# EAGLE design A2530 (EAGLE 7.1.0)
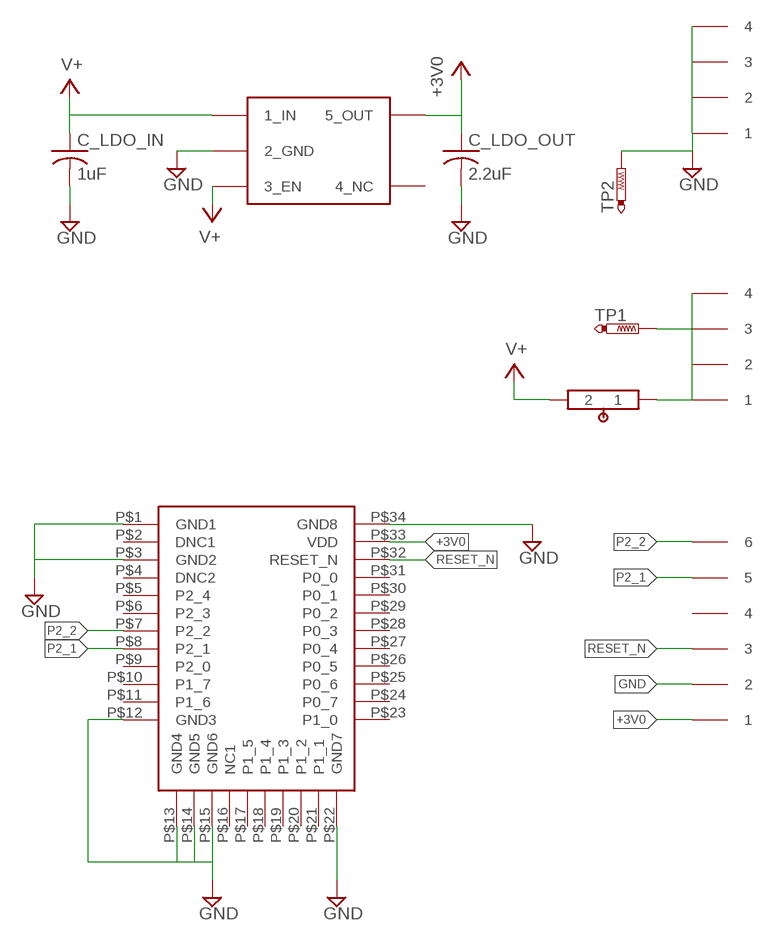
[diagram p0: schematic, sheet 1]

## Parts
C_LDO_IN  1uF  C-USC0603  [C0603]
C_LDO_OUT  2.2uF  C-USC0603  [C0603]
TP1  PTR1B2,54  [B2,54]
TP2  PTR1B2,54  [B2,54]
U$1  A2530  [A2530]
U$2  FFC6POS  [FFC6POS]
U$7  FFC4POS  [FFC4POS]
U$8  FFC4POS  [FFC4POS]
U$18  SWITCH_MANUAL  [SWITCH_MANUAL]
VREG1  REGULATOR  [REGULATOR]

## Nets
+3V0: C_LDO_OUT.1 U$1.P$33(VDD) U$2.1 VREG1.5(5_OUT)
GND: C_LDO_IN.2 C_LDO_OUT.2 TP2.TP U$1.P$1(GND1) U$1.P$3(GND2) U$1.P$12(GND3) U$1.P$13(GND4) U$1.P$14(GND5) U$1.P$15(GND6) U$1.P$22(GND7) U$1.P$34(GND8) U$2.2 U$8.1 U$8.2 U$8.3 U$8.4 VREG1.2(2_GND)
N$4: TP1.TP U$7.1 U$7.2 U$7.3 U$7.4 U$18.1
P2_1: U$1.P$8(P2_1) U$2.5
P2_2: U$1.P$7(P2_2) U$2.6
RESET_N: U$1.P$32(RESET_N) U$2.3
V+: C_LDO_IN.1 U$18.2 VREG1.1(1_IN) VREG1.3(3_EN)
Unconnected: U$1.P$2(DNC1) U$1.P$4(DNC2) U$1.P$5(P2_4) U$1.P$6(P2_3) U$1.P$9(P2_0) U$1.P$10(P1_7) U$1.P$11(P1_6) U$1.P$16(NC1) U$1.P$17(P1_5) U$1.P$18(P1_4) U$1.P$19(P1_3) U$1.P$20(P1_2) U$1.P$21(P1_1) U$1.P$23(P1_0) U$1.P$24(P0_7) U$1.P$25(P0_6) U$1.P$26(P0_5) U$1.P$27(P0_4) U$1.P$28(P0_3) U$1.P$29(P0_2) U$1.P$30(P0_1) U$1.P$31(P0_0) U$2.4 VREG1.4(4_NC)

## Library data of the parts
C_LDO_IN C_LDO_OUT = resistor:C-US: CAPACITOR, American symbol
TP1 TP2 = testpad:PTR1: TEST PIN
U$1 = CC2530_PCB_TL:A2530
U$2 = CC2530_PCB_TL:FFC6POS: FFC Connector 6POS
U$7 U$8 = CC2530_PCB_TL:FFC4POS: FFC COnnector 4POS
U$18 = CC2530_PCB_TL:SWITCH_MANUAL
VREG1 = CC2530_PCB_TL:REGULATOR: IC REG LDO 3V 50MA SOT23-5 TPS76030DBVT

## Board
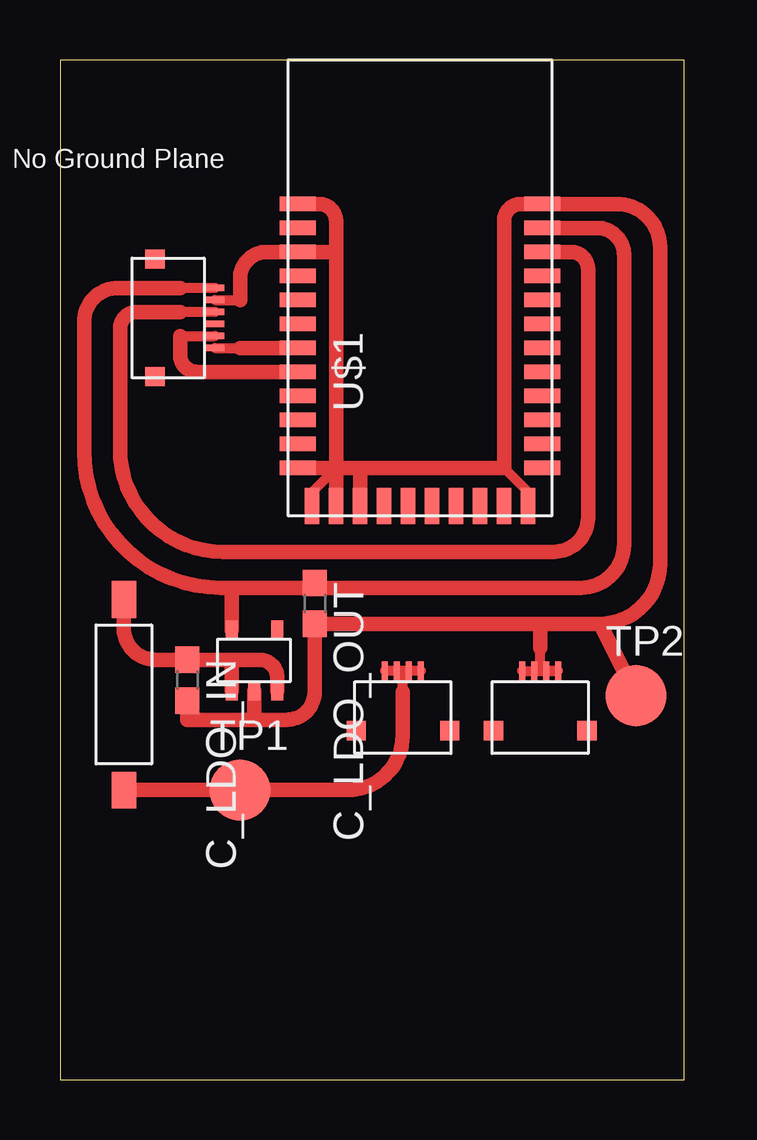
[diagram p1: board, top side]

Size 26 x 42.5 mm. Coordinates in mm from the lower left corner, seen from the top.
Outline: 0,0 26,0 26,42.5 0,42.5 0,0
Copper layers (1*16): Top 0.035mm / dielectric 1.5mm / Bottom 0.035mm
Design rules "default": minimum track width 10mil, minimum drill 24mil, track to track 8mil, track to pad 8mil, pad to pad 8mil, via to via 8mil, smd to smd 8mil, copper to edge 40mil, drill to drill 8mil, minimum pad ring 10mil, minimum via ring 8mil, stop-mask expansion 4mil, vias tented up to drill 0mil, thermal gap 10mil

### Footprints (pad centres in the part's own frame; a part is rotated, then mirrored left to right if it is on the bottom)
C0603 = smd 1.1 x 1: 1 -0.85,0; 2 0.85,0
B2,54 = smd 2.54 x 2.54: TP 0,0
A2530 = smd 1.5 x 0.61: P$1 -5.1,0; P$2 -5.1,-1; P$3 -5.1,-2; P$4 -5.1,-3; P$5 -5.1,-4; P$6 -5.1,-5; P$7 -5.1,-6; P$8 -5.1,-7; P$9 -5.1,-8; P$10 -5.1,-9; P$11 -5.1,-10; P$12 -5.1,-11; P$23 5.1,-11; P$24 5.1,-10; P$25 5.1,-9; P$26 5.1,-8; P$27 5.1,-7; P$28 5.1,-6; P$29 5.1,-5; P$30 5.1,-4; P$31 5.1,-3; P$32 5.1,-2; P$33 5.1,-1; P$34 5.1,0 | smd 0.61 x 1.5: P$13 -4.5,-12.6; P$14 -3.5,-12.6; P$15 -2.5,-12.6; P$16 -1.5,-12.6; P$17 -0.5,-12.6; P$18 0.5,-12.6; P$19 1.5,-12.6; P$20 2.5,-12.6; P$21 3.5,-12.6; P$22 4.5,-12.6
FFC6POS = smd 0.762 x 0.254: 1 0.008,1.269; 2 0.008,0.769; 3 0.008,0.269; 4 0.008,-0.231; 5 0.008,-0.731; 6 0.008,-1.231 | smd 0.8 x 0.8: P$7 -2.49,2.47; P$8 -2.49,-2.43
FFC4POS = smd 0.762 x 0.254: 1 0.04,0.742; 2 0.04,0.242; 3 0.04,-0.258; 4 0.04,-0.758 | smd 0.8 x 0.8: P$5 -2.46,1.94; P$6 -2.46,-1.96
SWITCH_MANUAL = smd 1.524 x 1.016: 1 -4.13,0; 2 3.81,0
REGULATOR = smd 0.5 x 0.8: 1 0.94,1.275; 2 0,1.275; 3 -0.95,1.275; 4 -0.95,-1.275; 5 0.95,-1.275

### Placement (x,y rotation side)
C_LDO_IN  5.31,16.65 270 top
C_LDO_OUT  10.62,19.85 270 top
TP1  7.5,12.07 0 top
TP2  24,16 0 top
U$1  15,36.5 0 top
U$2  6.45,31.73 0 top
U$7  14.28,17 90 top
U$8  20,17 90 top
U$18  2.66,16.2 90 top
VREG1  8.1,17.47 180 top

### Tracks (layer width: path | path; a pad name or v marks a point on that pad's centre or on a via)
+3V0
  Top 0.406: U$2.1 5.5,33 5,33
  Top 0.61: 10.5,20.5 21.7,20.5 arc90 23.5,22.3 23.5,34.38 arc90 22.38,35.5 22,35.5 U$1.P$33 | 5,33 2.41,33 arc90 1,31.59 1,26.2 arc90 6.7,20.5 7,20.5 7.15,20.5 | 10.5,20.5 7.15,20.5 | C_LDO_OUT.1 10.5,20.7 10.5,20.5 | VREG1.5 7.15,20.5
GND
  Top 0.406: U$1.P$13 10.5,24.5 11.5,25.5 | U$1.P$22 19.5,24.5 18.5,25.5 | U$1.P$3 | U$8.1 U$8.2 U$8.3 U$8.4 | U$2.2 7.5,32.5 | U$8.4 | U$8.4 20,17.04 20,18
  Top 0.61: U$1.P$12 11.5,25.5 | 12.5,25.5 U$1.P$15 | U$1.P$14 11.5,25.5 | U$1.P$1 10.79,36.5 arc-90 11.5,35.79 11.5,34.5 | 11.5,34.5 11.5,25.5 | 12.5,25.5 18.5,25.5 18.5,35.79 arc-90 19.21,36.5 U$1.P$34 23.2,36.5 arc-90 25,34.7 25,21.5 arc-90 22.5,19 | 12.5,25.5 11.5,25.5 | 11.5,34.5 U$1.P$3 8.62,34.5 arc90 7.5,33.38 7.5,32.5 | 22.5,19 20,19 | 20,19 C_LDO_OUT.2 10.62,16.18 arc-90 9.44,15 8.1,15 | VREG1.2 8.1,15 | 8.1,15 5.31,15 C_LDO_IN.2 | 20,18 20,19 | TP2.TP 22.5,19
N$4
  Top 0.406: U$7.4 U$7.3 U$7.2 | U$7.2 U$7.1 | 14.28,16.16 14.28,17.04 U$7.2
  Top 0.61: 12,12.07 arc90 14.28,14.35 14.28,16.16 | U$18.1 TP1.TP | TP1.TP | TP1.TP 12,12.07 | 12,12.07
P2_1
  Top 0.406: 5,31 U$2.5
  Top 0.61: U$1.P$8 5.71,29.5 arc-90 5,30.21 5,31
P2_2
  Top 0.406: U$1.P$7 | U$2.6 7.5,30.5
  Top 0.61: 7.5,30.5 U$1.P$7
RESET_N
  Top 0.406: U$2.3 5,32
  Top 0.61: U$1.P$32 21.29,34.5 arc-90 22,33.79 22,23.41 arc-90 20.59,22 6.8,22 arc-90 2.5,26.3 2.5,31.29 arc-90 3.21,32 5,32
V+
  Top 0.61: VREG1.1 7.16,17.5 | VREG1.3 9.05,16.76 arc90 8.31,17.5 7.16,17.5 | 7.16,17.5 C_LDO_IN.1 3.97,17.5 arc-90 2.66,18.81 U$18.2